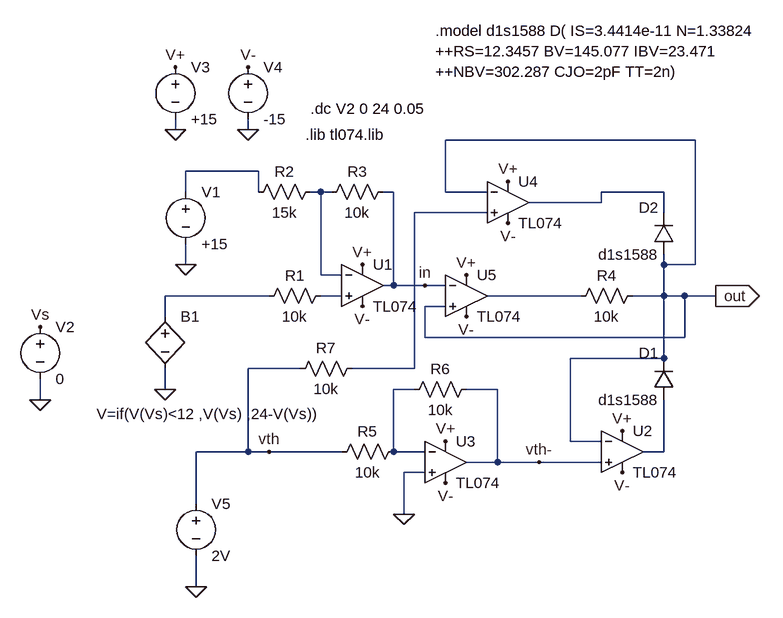
[diagram p0: schematic fig22updownIF.asc]
fig22updownIF.asc, the LTspice schematic file:
Version 4
SHEET 1 924 680
WIRE -240 -1216 -240 -1232
WIRE -128 -1216 -128 -1232
WIRE 560 -1200 176 -1200
WIRE -112 -1152 -224 -1152
WIRE -224 -1120 -224 -1152
WIRE -112 -1120 -112 -1152
WIRE -16 -1120 -32 -1120
WIRE 0 -1120 -16 -1120
WIRE 96 -1120 80 -1120
WIRE 176 -1120 176 -1200
WIRE 240 -1120 176 -1120
WIRE 512 -1120 416 -1120
WIRE 416 -1104 416 -1120
WIRE 416 -1104 304 -1104
WIRE 240 -1088 128 -1088
WIRE 512 -1088 512 -1120
WIRE -224 -1008 -224 -1040
WIRE 512 -1008 512 -1024
WIRE 560 -1008 560 -1200
WIRE 560 -1008 512 -1008
WIRE -16 -992 -16 -1120
WIRE 16 -992 -16 -992
WIRE 96 -976 96 -1120
WIRE 96 -976 80 -976
WIRE 144 -976 96 -976
WIRE 176 -976 144 -976
WIRE -96 -960 -256 -960
WIRE 16 -960 -16 -960
WIRE 384 -960 240 -960
WIRE 512 -960 512 -1008
WIRE 512 -960 464 -960
WIRE 544 -960 512 -960
WIRE 592 -960 544 -960
WIRE 176 -944 144 -944
WIRE -256 -928 -256 -960
WIRE 144 -896 144 -944
WIRE 544 -896 544 -960
WIRE 544 -896 144 -896
WIRE 512 -864 512 -960
WIRE 512 -864 368 -864
WIRE -48 -848 -128 -848
WIRE 128 -848 128 -1088
WIRE 128 -848 32 -848
WIRE -256 -816 -256 -848
WIRE 128 -816 96 -816
WIRE 256 -816 208 -816
WIRE -448 -800 -448 -832
WIRE 368 -736 368 -864
WIRE 416 -736 368 -736
WIRE -128 -720 -128 -848
WIRE -128 -720 -208 -720
WIRE -96 -720 -128 -720
WIRE 16 -720 -96 -720
WIRE 96 -720 96 -816
WIRE 144 -720 96 -720
WIRE 512 -720 512 -800
WIRE 512 -720 480 -720
WIRE 256 -704 256 -816
WIRE 256 -704 208 -704
WIRE 320 -704 256 -704
WIRE 416 -704 320 -704
WIRE 144 -688 112 -688
WIRE -208 -640 -208 -720
WIRE 112 -624 112 -688
WIRE -208 -512 -208 -560
FLAG -224 -1008 0
FLAG -448 -800 0
FLAG 112 -624 0
FLAG 592 -960 out
IOPIN 592 -960 Out
FLAG -240 -1216 0
FLAG -128 -1216 0
FLAG -240 -1312 V+
FLAG -128 -1312 V-
FLAG 48 -1008 V+
FLAG 48 -944 V-
FLAG 448 -752 V+
FLAG 448 -688 V-
FLAG -208 -512 0
FLAG 144 -976 in
FLAG -96 -720 vth
FLAG 320 -704 vth-
FLAG 176 -736 V+
FLAG 208 -992 V+
FLAG 272 -1136 V+
FLAG 272 -1072 V-
FLAG 208 -928 V-
FLAG 176 -672 V-
FLAG -448 -912 Vs
FLAG -256 -816 0
SYMBOL Opamps\\opamp2 48 -1040 R0
SYMATTR InstName U1
SYMATTR Value TL074
SYMBOL res -112 -944 R270
WINDOW 0 32 56 VTop 0
WINDOW 3 0 56 VBottom 0
SYMATTR InstName R1
SYMATTR Value 10k
SYMBOL res -128 -1104 R270
WINDOW 0 32 56 VTop 0
WINDOW 3 0 56 VBottom 0
SYMATTR InstName R2
SYMATTR Value 15k
SYMBOL res -16 -1104 R270
WINDOW 0 32 56 VTop 0
WINDOW 3 0 56 VBottom 0
SYMATTR InstName R3
SYMATTR Value 10k
SYMBOL res 368 -944 R270
WINDOW 0 32 56 VTop 0
WINDOW 3 0 56 VBottom 0
SYMATTR InstName R4
SYMATTR Value 10k
SYMBOL voltage -224 -1136 R0
WINDOW 123 0 0 Left 0
WINDOW 39 0 0 Left 0
SYMATTR InstName V1
SYMATTR Value +15
SYMBOL voltage -448 -928 R0
WINDOW 123 0 0 Left 0
WINDOW 39 0 0 Left 0
SYMATTR InstName V2
SYMATTR Value 0
SYMBOL diode 528 -800 R180
WINDOW 0 24 72 Left 0
WINDOW 3 24 0 Left 0
SYMATTR InstName D1
SYMATTR Value d1s1588
SYMBOL voltage -240 -1328 R0
SYMATTR InstName V3
SYMATTR Value +15
SYMBOL voltage -128 -1328 R0
SYMATTR InstName V4
SYMATTR Value -15
SYMBOL Opamps\\opamp2 448 -784 R0
SYMATTR InstName U2
SYMATTR Value TL074
SYMBOL voltage -208 -656 R0
WINDOW 123 0 0 Left 0
WINDOW 39 0 0 Left 0
SYMATTR InstName V5
SYMATTR Value 2V
SYMBOL Opamps\\opamp2 176 -768 R0
SYMATTR InstName U3
SYMATTR Value TL074
SYMBOL Opamps\\opamp2 272 -1168 R0
SYMATTR InstName U4
SYMATTR Value TL074
SYMBOL Opamps\\opamp2 208 -1024 R0
SYMATTR InstName U5
SYMATTR Value TL074
SYMBOL res 0 -704 R270
WINDOW 0 32 56 VTop 0
WINDOW 3 0 56 VBottom 0
SYMATTR InstName R5
SYMATTR Value 10k
SYMBOL res 112 -800 R270
WINDOW 0 32 56 VTop 0
WINDOW 3 0 56 VBottom 0
SYMATTR InstName R6
SYMATTR Value 10k
SYMBOL res -64 -832 R270
WINDOW 0 32 56 VTop 0
WINDOW 3 0 56 VBottom 0
SYMATTR InstName R7
SYMATTR Value 10k
SYMBOL diode 528 -1024 R180
WINDOW 0 24 72 Left 0
WINDOW 3 24 0 Left 0
SYMATTR InstName D2
SYMATTR Value d1s1588
SYMBOL bv -256 -944 R0
WINDOW 3 -105 166 Left 0
SYMATTR InstName B1
SYMATTR Value V=if(V(Vs)<12 ,V(Vs) ,24-V(Vs))
TEXT -32 -1248 Left 0 !.dc V2 0 24 0.05
TEXT -40 -1208 Left 0 !.lib tl074.lib
TEXT 160 -1368 Left 0 !.model d1s1588 D( IS=3.4414e-11 N=1.33824 \n++RS=12.3457 BV=145.077 IBV=23.471 \n++NBV=302.287 CJO=2pF TT=2n)

The netlist it stands for:
* fig22updownIF.asc
XU1 N006 N002 V+ V- in TL074  ; pins In+ In- V+ V- OUT
R1 N005 N006 10k
R2 N001 N002 15k
R3 N002 in 10k
R4 N007 out 10k
V1 N001 0 +15
V2 Vs 0 0
D1 N009 out d1s1588
V3 V+ 0 +15
V4 V- 0 -15
XU2 vth- out V+ V- N009 TL074  ; pins In+ In- V+ V- OUT
V5 vth 0 2V
XU3 0 N008 V+ V- vth- TL074  ; pins In+ In- V+ V- OUT
XU4 N004 out V+ V- N003 TL074  ; pins In+ In- V+ V- OUT
XU5 out in V+ V- N007 TL074  ; pins In+ In- V+ V- OUT
R5 vth N008 10k
R6 N008 vth- 10k
R7 vth N004 10k
D2 out N003 d1s1588
B1 N005 0 V=if(V(Vs)<12 ,V(Vs) ,24-V(Vs))
.model D D
.lib standard.dio
.dc V2 0 24 0.05
.lib tl074.lib
.model d1s1588 D( IS=3.4414e-11 N=1.33824
++RS=12.3457 BV=145.077 IBV=23.471
++NBV=302.287 CJO=2pF TT=2n)
.backanno
.end